# Altium schematic sheet Sheet2.SchDoc
size A4; SheetNumber: 2; SheetTotal: 2
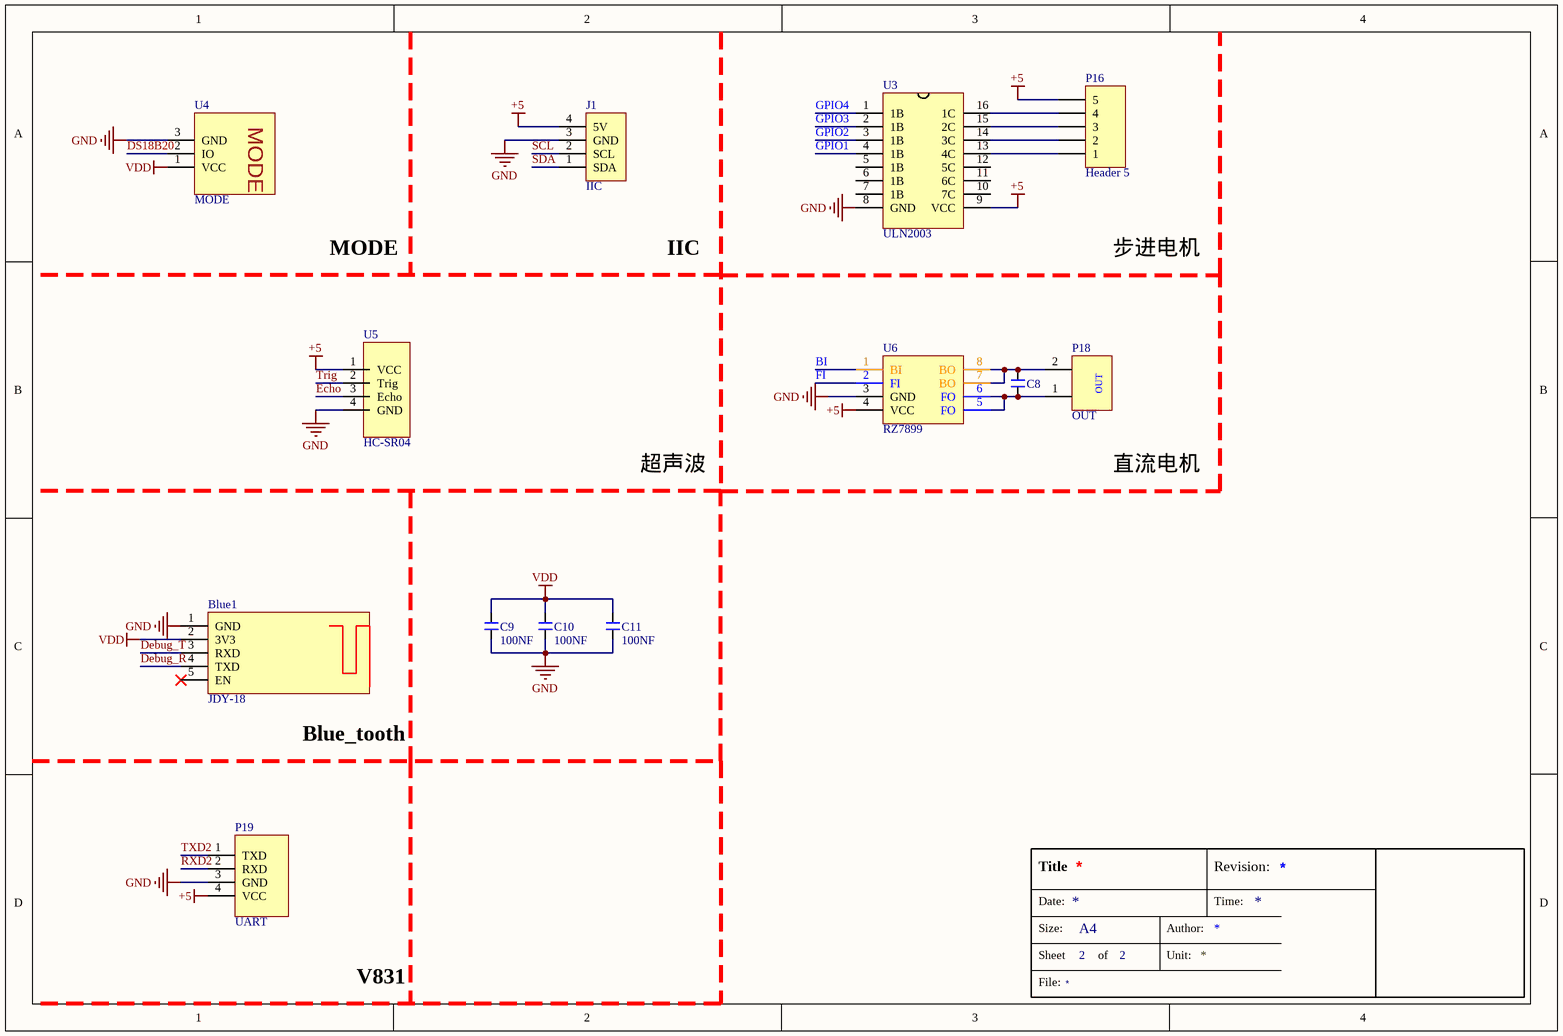
[diagram p0: Sheet2.SchDoc]

## Parts
Blue1  JDY-18  [uart-Haerd]
C8  100NF  [CAP_0603]  (value not drawn)
C9  100NF  [CAP_0603]
C10  100NF  [CAP_0603]
C11  100NF  [CAP_0603]
J1  IIC  [IIC-XH2.54-4PIN]
P16  Header 5  [XH2.54-WI-5P]
P18  OUT  [XH2.54-WI-2P]
P19  UART  [UART]
U3  ULN2003  [SOP16]
U4  MODE  [Header F 2.54X3]
U5  HC-SR04  [Ultrasonic]
U6  RZ7899  [SOP_8_M]

## Nets
+5: J1.4(5V) P16.5 P19.4(VCC) U3.9(VCC) U5.1(VCC) U6.4(VCC)
GND: Blue1.1(GND) C9.1 C10.1 C11.1 J1.3(GND) P19.3(GND) U3.8(GND) U4.3(GND) U5.4(GND) U6.3(GND)
VDD: Blue1.2(3V3) C9.2 C10.2 C11.2 U4.1(VCC)
BI: U6.1(BI)
Debug_R: Blue1.4(TXD)
Debug_T: Blue1.3(RXD)
DS18B20: U4.2(IO)
Echo: U5.3(Echo)
FI: U6.2(FI)
GPIO1: U3.4(1B)
GPIO2: U3.3(1B)
GPIO3: U3.2(1B)
GPIO4: U3.1(1B)
RXD2: P19.2(RXD)
SCL: J1.2(SCL)
SDA: J1.1(SDA)
Trig: U5.2(Trig)
TXD2: P19.1(TXD)
NetC8_1: C8.1 P18.1 U6.5(FO) U6.6(FO)
NetC8_2: C8.2 P18.2 U6.7(BO) U6.8(BO)
NetP16_1: P16.1 U3.13(4C)
NetP16_2: P16.2 U3.14(3C)
NetP16_3: P16.3 U3.15(2C)
NetP16_4: P16.4 U3.16(1C)

Not connected (* = marked no-connect by the designer): Blue1 5(EN)*; U3 5(1B) 6(1B) 7(1B) 10(7C) 11(6C) 12(5C)

## Notes on the sheet
- MODE
- IIC
- 步进电机
- 超声波
- 直流电机
- Blue_tooth
- V831
- Title
- Date:
- Revision:
- Time:
- File:
- Size:
- Sheet
- A4
- of
- Author:
- Unit:

## Library data of the parts
Blue1 = JDY-18: MODE
C8-C11 = CAP: CAP  12~50V
J1 = IIC: Heard
P16 = Header 5: Header, 5-Pin; LatestRevisionDate: 17-Jul-2002; LatestRevisionNote: Re-released for DXP Platform.; Publisher: Altium Limited
P18 = OUT_2PIN: Header
P19 = UART: Header
U3 = ULN2003: IC
U4 = MODE_3Pin
U5 = Ultrasonic: Mode
U6 = RZ7899: Dreiv